# EAGLE design esp8266 (EAGLE 8.6.0)
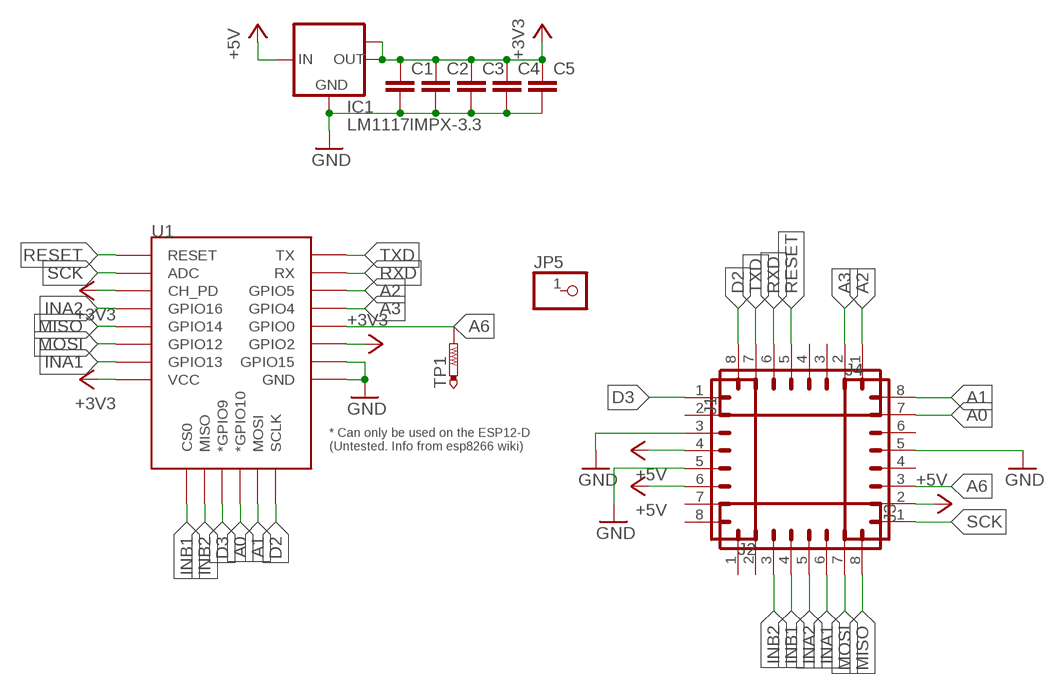
[diagram p0: schematic, sheet 1]

## Parts
C1  C-EUC1206K  [C1206K]
C2  C-EUC1206K  [C1206K]
C3  C-EUC1206K  [C1206K]
C4  C-EUC1206K  [C1206K]
C5  C-EUC1206K  [C1206K]
IC1  LM1117IMPX-3.3  [SOT223]
J1  CONN_08SMD-STRAIGHT-ALT-FEMALE  [1X08_SMD_ALT]
J2  CONN_08SMD-STRAIGHT-ALT-FEMALE  [1X08_SMD_ALT]
J3  CONN_08SMD-STRAIGHT-ALT-FEMALE  [1X08_SMD_ALT]
J4  CONN_08SMD-STRAIGHT-ALT-FEMALE  [1X08_SMD_ALT]
JP5  PINHD-1X1  [1X01]
TP1  PTR1B1,27  [B1,27]
U1  ESP12ESMD  [ESP12E-SMD]

## Nets
+3V3: C1.1 C2.1 C3.1 C4.1 C5.1 IC1.2(OUT) IC1.TAB(OUT1) U1.CH_PD U1.GPIO2 U1.VCC
+5V: IC1.3(IN) J2.4 J2.6 J4.2
A0: J4.7 U1.GPIO10(*GPIO10)
A1: J4.8 U1.MOSI
A2: J1.1 U1.GPIO5
A3: J1.2 U1.GPIO4
A6: J4.3 TP1.TP U1.GPIO0
D2: J1.8 U1.SCLK
D3: J2.1 U1.GPIO9(*GPIO9)
GND: C1.2 C2.2 C3.2 C4.2 C5.2 IC1.1(GND) J2.3 J2.5 J4.5 U1.GND U1.GPIO15
INA1: J3.6 U1.GPIO13
INA2: J3.5 U1.GPIO16
INB1: J3.4 U1.CS0
INB2: J3.3 U1.MISO
MISO: J3.8 U1.GPIO14
MOSI: J3.7 U1.GPIO12
RESET: J1.5 U1.RESET
RXD: J1.6 U1.RXD0(RX)
SCK: J4.1 U1.ADC
TXD: J1.7 U1.TXD0(TX)
Unconnected: J1.3 J1.4 J2.2 J2.7 J2.8 J3.1 J3.2 J4.4 J4.6 JP5.1

## Library data of the parts
C1-C5 = rcl:C-EU: CAPACITOR, European symbol; SPICEPREFIX: C
IC1 = lm1117:LM1117IMPX-*
J1-J4 = SparkFun-Connectors:CONN_08: Multi connection point. Often used as Generic Header-pin footprint for 0.1 inch spaced/style header connections On any of the 0.1 inch spaced packages, you can populate with these: Break Away Headers - Straight <https://www.sparkfun.com/products/116> (PRT-00116) Break Away Male Headers - Right Angle <https://www.sparkfun.com/products/553> (PRT-00553) Female Headers <https://www.sparkfun.com/products/115> (PRT-00115) Break Away Headers - Machine Pin <https://www.sparkfun.com/products/117> (PRT-00117) Break Away Female Headers - Swiss Machine Pin <https://www.sparkfun.com/products/743> (PRT-00743) Arduino Stackable Header - 8 Pin <https://www.sparkfun.com/products/9279> (PRT-09279) For SCREWTERMINALS and SPRING TERMINALS visit here: Screw Terimnals on SparkFun.com <https://www.sparkfun.com/search/results?term=Screw+Terminals> (5mm/3.5mm/2.54mm spacing) This device is also useful as a general connection point to wire up your design to another part of your project. Our various solder wires solder well into these plated through hole pads. Hook-Up Wire - Assortment (Stranded, 22 AWG) <https://www.sparkfun.com/products/11375> (PRT-11375) Hook-Up Wire - Assortment (Solid Core, 22 AWG) <https://www.sparkfun.com/products/11367> (PRT-11367) View the entire wire category on our website here <https://www.sparkfun.com/categories/141> Special notes: Molex polarized connector foot print use with SKU : PRT-08231 with associated crimp pins and housings. 1MM SMD Version SKU: PRT-10208 NOTES ON THE VARIANTS LOCK and LOCK_LONGPADS... This footprint was designed to help hold the alignment of a through-hole component (i.e. 6-pin header) while soldering it into place. You may notice that each hole has been shifted either up or down by 0.005 of an inch from it's more standard position (which is a perfectly straight line). This slight alteration caused the pins (the squares in the middle) to touch the edges of the holes. Because they are alternating, it causes a "brace" to hold the component in place. 0.005 has proven to be the perfect amount of "off-center" position when using our standard breakaway headers. Although looks a little odd when you look at the bare footprint, once you have a header in there, the alteration is very hard to notice. Also,if you push a header all the way into place, it is covered up entirely on the bottom side.; PROD_ID: CONN-10204; SF_ID: PRT-11543
JP5 = pinhead:PINHD-1X1: PIN HEADER
TP1 = testpad:PTR1: TEST PIN
U1 = esp12e:ESP12E: ESP12E Module

## Board
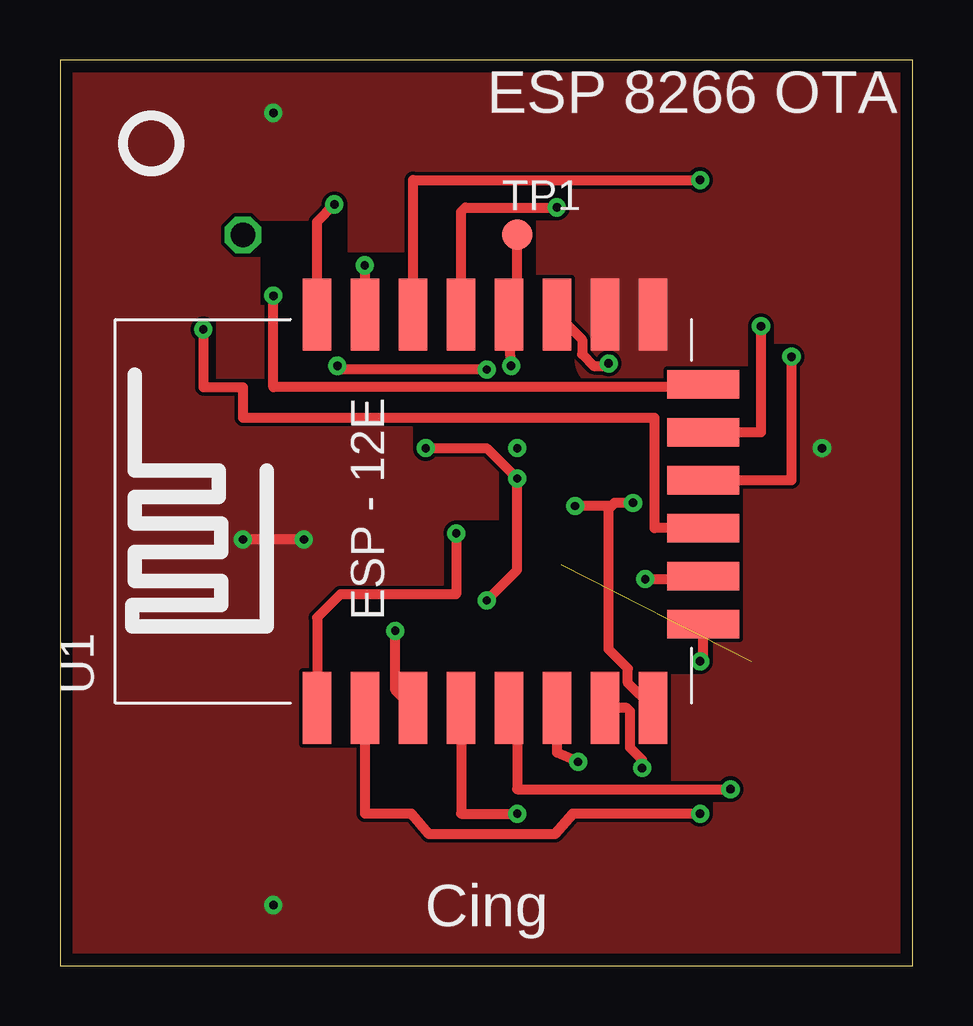
[diagram p1: board, top side]
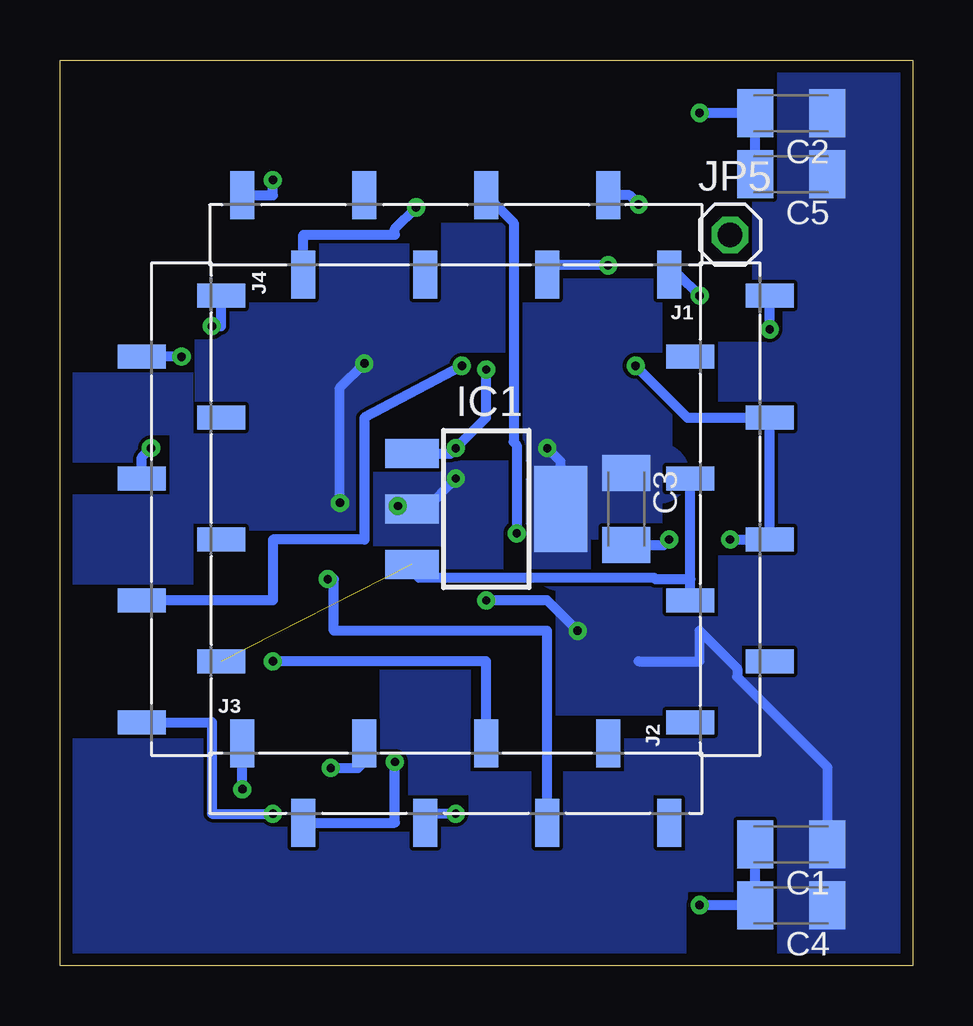
[diagram p2: board, bottom side, seen from below]

Size 35.54 x 37.77 mm. Coordinates in mm from the lower left corner, seen from the top.
Outline: 0,0 35.54,0 35.54,37.77 0,37.77 0,0
Copper layers (1*16): Top 0.035mm / dielectric 1.5mm / Bottom 0.035mm
Design rules "default *": minimum track width 6mil, minimum drill 0.35mm, track to track 6mil, track to pad 6mil, pad to pad 6mil, via to via 6mil, smd to smd 6mil, copper to edge 20mil, drill to drill 6mil, minimum pad ring 10mil, minimum via ring 8mil, stop-mask expansion 4mil, vias tented up to drill 0mil, thermal gap 10mil

### Footprints (pad centres in the part's own frame; a part is rotated, then mirrored left to right if it is on the bottom)
C1206K = smd 1.5 x 2: 1 -1.5,0; 2 1.5,0
SOT223 = smd 1.219 x 2.235: 1 -2.311,-3.099; 2 0,-3.099; 3 2.311,-3.099 | smd 3.6 x 2.2: TAB 0,3.099
1X08_SMD_ALT = smd 1 x 2: 1 0,-1.65; 2 -2.54,1.65; 3 -5.08,-1.65; 4 -7.62,1.65; 5 -10.16,-1.65; 6 -12.7,1.65; 7 -15.24,-1.65; 8 -17.78,1.65
1X01 = drill 1.016 octagon: 1 0,0
B1,27 = smd 1.27 x 1.27: TP 0,0
ESP12E-SMD = smd 3 x 1.2: ADC -8.3,3.8; CH_PD -8.3,1.8; GND 8.1,-8.2; GPIO0 8.1,-2.2; GPIO2 8.1,-4.2; GPIO4 8.1,-0.2; GPIO5 8.1,1.8; GPIO12 -8.3,-4.2; GPIO13 -8.3,-6.2; GPIO14 -8.3,-2.2; GPIO15 8.1,-6.2; GPIO16 -8.3,-0.2; RESET -8.3,5.8; RXD0 8.1,3.8; TXD0 8.1,5.8; VCC -8.3,-8.2 | smd 1.2 x 3: CS0 -4.8,-10.3; GPIO9 -0.8,-10.3; GPIO10 1.2,-10.3; MISO -2.8,-10.3; MOSI 3.2,-10.3; SCLK 5.2,-10.3

### Placement (x,y rotation side)
C1  5.08,5.08 180 bottom
C2  5.08,35.56 180 bottom
C3  11.94,19.05 270 bottom
C4  5.08,2.54 180 bottom
C5  5.08,33.02 180 bottom
IC1  17.78,19.05 270 bottom
J1  27.94,30.48 180 bottom
J2  7.62,27.94 90 bottom
J3  10.16,7.62 0 bottom
J4  30.48,10.16 270 bottom
JP5  7.62,30.48 0 bottom
TP1  19.05,30.48 0 top
U1  16.51,19.05 90 top

### Tracks (layer width: path | path; a pad name or v marks a point on that pad's centre or on a via)
+3V3  (via drill 0.35)
  Top 0.406: U1.CH_PD 13.97,11.49 v13.97,13.97 | U1.VCC 23.67,11.79 23.67,12.4 22.86,13.2 22.86,19.05 | 22.86,19.05 22.86,19.18 v21.46,19.18 | U1.GPIO2 21.75,26.11 21.75,25.5 22.24,25.02 22.86,25.02 v22.86,25.12 | v23.88,19.3 23.11,19.3 22.86,19.05 | v15.24,21.59 17.78,21.59 v19.05,20.32 19.05,16.51 v17.78,15.24
  Bottom 0.406: C1.1 3.58,8.31 7.33,12.05 7.33,12.41 8.89,13.97 8.89,12.7 11.43,12.7 | v21.46,19.18 20.88,19 | 20.88,19 IC1.2 | v22.86,25.12 23.88,24.1 v23.88,19.3 | IC1.TAB 14.68,21.03 v15.24,21.59 | v19.05,20.32 20.37,19 20.88,19 | v13.97,13.97 15.24,15.24 v17.78,15.24
  pour Bottom: 38.1,39.37 38.1,0 0,0 0,39.37
+5V  (1 unrouted)
  Bottom 0.406: J2.6 9.27,16.13 | 9.27,16.13 J2.4 | 9.27,16.13 10.72,16.13 10.79,16.19 20.58,16.19 IC1.3
A0  (via drill 0.35)
  Top 0.406: U1.GPIO10 30.48,20.25 v30.48,25.4
  Bottom 0.406: v30.48,25.4 J4.7
A1  (via drill 0.35)
  Top 0.406: U1.MOSI 29.21,22.25 v29.21,26.67
  Bottom 0.406: v29.21,26.67 28.83,26.67 J4.8
A2  (via drill 0.35)
  Top 0.406: U1.GPIO5 14.71,32.77 v26.67,32.77
  Bottom 0.406: J1.1 26.67,32.13 v26.67,32.77
A3  (via drill 0.35)
  Top 0.406: U1.GPIO4 16.71,31.44 16.89,31.62 v20.7,31.62
  Bottom 0.406: J1.2 25.4,30.48 21.59,30.48 21.59,30.73 v20.7,31.62
A6  (via drill 0.35)
  Top 0.406: TP1.TP 19.05,27.49 U1.GPIO0 18.71,25.74 v18.8,25.02
  Bottom 0.406: v18.8,25.02 22.86,22.86 22.86,17.78 26.67,17.78 26.67,15.24 J4.3
D2  (via drill 0.35)
  Top 0.406: U1.SCLK 26.69,24.13 8.89,24.13 v8.89,27.94
  Bottom 0.406: v8.89,27.94 9.78,28.83 J1.8
D3  (via drill 0.35)
  Top 0.406: U1.GPIO9 24.77,18.25 24.77,22.86 7.62,22.86 7.62,24.13 5.97,24.13 v5.97,26.54
  Bottom 0.406: v5.97,26.54 J2.1
GND  (via drill 0.35)
  Top 0.406: v10.16,17.78 v7.62,17.78 | v17.78,24.86 11.71,24.86 v11.56,25.02
  Bottom 0.406: v8.89,35.56 C2.2 C5.2 | C1.2 C4.2 v8.89,2.54 | C3.2 10.39,17.55 v10.16,17.78 | v7.62,17.78 J2.5 J2.3 9.4,22.86 v11.56,25.02 | J4.5 32.13,21.21 v31.75,21.59 | IC1.1 19.28,21.36 v19.05,21.59 17.78,22.86 v17.78,24.86
  pour Top: 0,39.37 38.1,39.37 38.1,0 1.27,0 0,0
INA1  (via drill 0.35)
  Top 0.406: U1.GPIO13 23.62,10.75 23.75,10.62 23.75,9.1 24.26,8.6 v24.26,8.25
  Bottom 0.406: J3.6 22.86,8.51 23.11,8.25 v24.26,8.25
INA2  (via drill 0.35)
  Top 0.406: U1.GPIO16 16.71,6.35 v19.05,6.35
  Bottom 0.406: v19.05,6.35 20.32,6.35 J3.5
INB1  (via drill 0.35)
  Top 0.406: v26.67,12.7 26.81,12.7 U1.CS0
  Bottom 0.406: J3.4 17.78,12.7 v26.67,12.7
INB2  (via drill 0.35)
  Top 0.406: v24.38,16.13 26.81,16.13 U1.MISO
  Bottom 0.406: J3.3 15.24,13.97 24.13,13.97 24.13,16.13 v24.38,16.13
MISO  (via drill 0.35)
  Top 0.406: U1.GPIO14 19.05,10.75 19.05,7.37 v27.94,7.37
  Bottom 0.406: v27.94,7.37 J3.8
MOSI  (via drill 0.35)
  Top 0.406: v21.59,8.51 20.71,8.89 U1.GPIO12
  Bottom 0.406: J3.7 21.59,5.97 v21.59,8.51
RESET  (via drill 0.35)
  Top 0.406: v16.51,18.03 16.51,15.49 11.68,15.49 10.71,14.52 U1.RESET
  Bottom 0.406: J1.5 16.64,30.99 16.64,21.84 16.51,21.72 v16.51,18.03
RXD  (via drill 0.35)
  Top 0.406: U1.RXD0 v12.71,29.2 v12.7,29.21
  Bottom 0.406: v12.7,29.21 15.24,29.21 J1.6
SCK  (via drill 0.35)
  Top 0.406: v26.67,6.35 21.36,6.35 20.62,5.49 15.38,5.49 14.65,6.35 12.71,6.35 U1.ADC
  Bottom 0.406: J4.1 29.21,10.16 29.21,6.35 v26.67,6.35
TXD  (via drill 0.35)
  Top 0.406: U1.TXD0 10.71,31.03 v11.43,31.75
  Bottom 0.406: v11.43,31.75 11.81,32.13 J1.7

### Text on the board
tNames: ESP 8266 OTA | Cing